# Altium project NeuroMother.PrjPcb
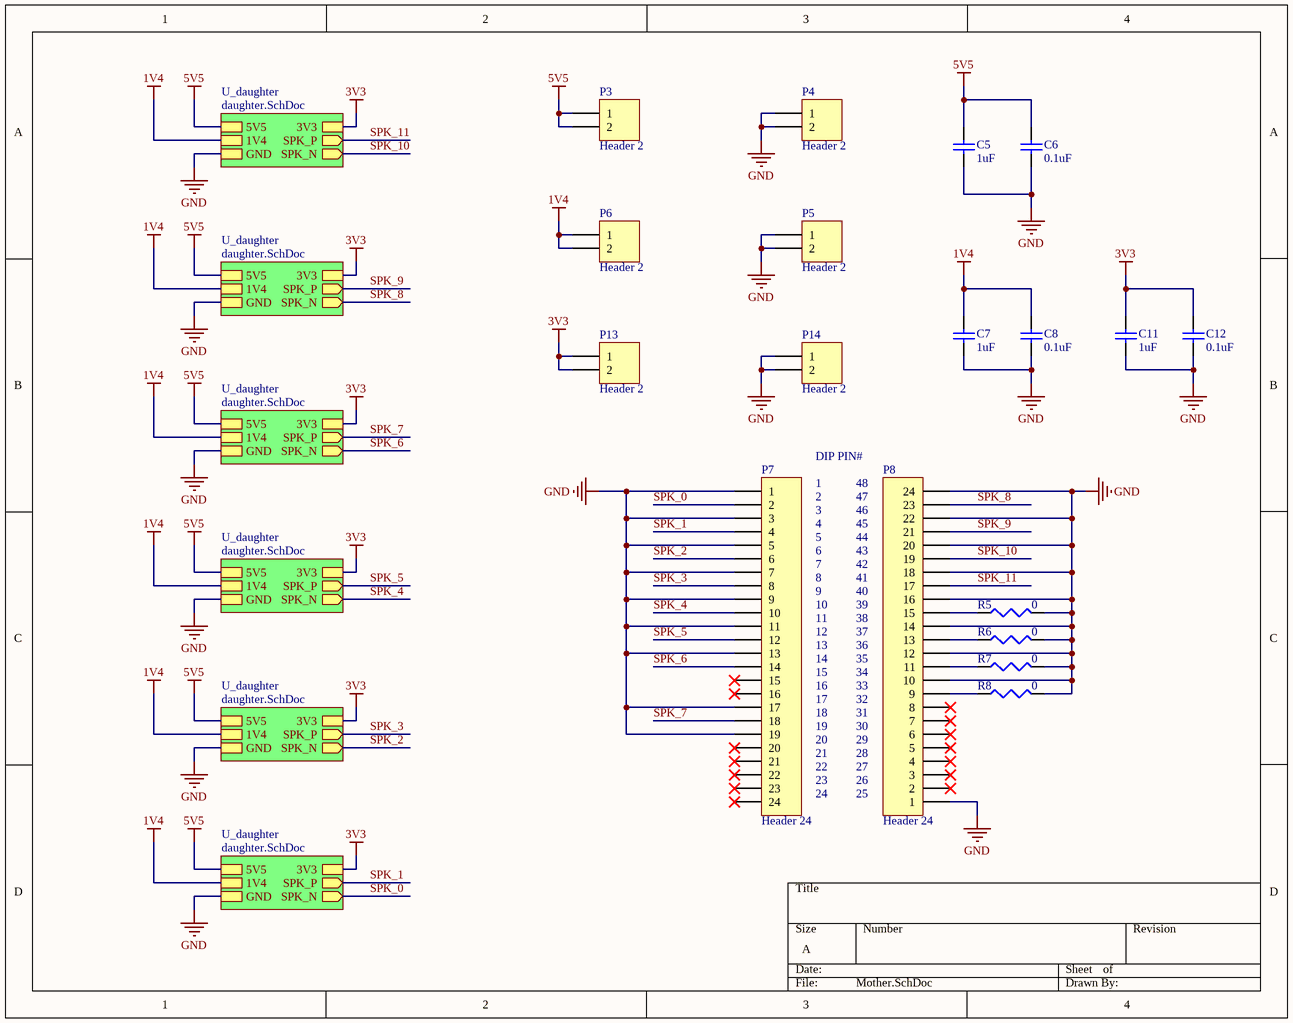
[diagram p0: Mother.SchDoc]
2 sheets, 186 parts. Net scope: strictly hierarchical (ports join the sheet entries above them; power ports are local).
Board file: NeuroMother_A.PcbDoc
Sheets:
  Mother.SchDoc
    U_daughter = daughter.SchDoc
    U_daughter = daughter.SchDoc
    U_daughter = daughter.SchDoc
    U_daughter = daughter.SchDoc
    U_daughter = daughter.SchDoc
    U_daughter = daughter.SchDoc

## Sheet Mother.SchDoc
size A; SheetNumber: 1; SheetTotal: 2

### Parts
C5  1uF  [SMD-0805]
C6  0.1uF  [SMD-0603]
C7  1uF  [SMD-0805]
C8  0.1uF  [SMD-0603]
C11  1uF  [SMD-0805]
C12  0.1uF  [SMD-0603]
P3  Header 2  [HDR1X2]
P4  Header 2  [HDR1X2]
P5  Header 2  [HDR1X2]
P6  Header 2  [HDR1X2]
P7  Header 24  [HDR1X24]
P8  Header 24  [HDR1X24]
P13  Header 2  [HDR1X2]
P14  Header 2  [HDR1X2]
R5  0  [SMD-0603]
R6  0  [SMD-0603]
R7  0  [SMD-0603]
R8  0  [SMD-0603]

### Sub-sheets
U_daughter = daughter.SchDoc: 1V4, 5V5, SPK_P (out), SPK_N (out), GND, 3V3
U_daughter = daughter.SchDoc: 1V4, 5V5, SPK_P (out), SPK_N (out), GND, 3V3
U_daughter = daughter.SchDoc: 1V4, 5V5, SPK_P (out), SPK_N (out), GND, 3V3
U_daughter = daughter.SchDoc: 1V4, 5V5, SPK_P (out), SPK_N (out), GND, 3V3
U_daughter = daughter.SchDoc: 1V4, 5V5, SPK_P (out), SPK_N (out), GND, 3V3
U_daughter = daughter.SchDoc: 1V4, 5V5, SPK_P (out), SPK_N (out), GND, 3V3

### Nets
1V4: C7.2 C8.2 P6.1 P6.2 ; sheet U_daughter/1V4, sheet U_daughter/1V4, sheet U_daughter/1V4, sheet U_daughter/1V4, sheet U_daughter/1V4, sheet U_daughter/1V4
3V3: C11.2 C12.2 P13.1 P13.2 ; sheet U_daughter/3V3, sheet U_daughter/3V3, sheet U_daughter/3V3, sheet U_daughter/3V3, sheet U_daughter/3V3, sheet U_daughter/3V3
5V5: C5.2 C6.2 P3.1 P3.2 ; sheet U_daughter/5V5, sheet U_daughter/5V5, sheet U_daughter/5V5, sheet U_daughter/5V5, sheet U_daughter/5V5, sheet U_daughter/5V5
GND: C5.1 C6.1 C7.1 C8.1 C11.1 C12.1 P4.1 P4.2 P5.1 P5.2 P7.1 P7.3 P7.5 P7.7 P7.9 P7.11 P7.13 P7.17 P7.19 P8.1 P8.10 P8.12 P8.14 P8.16 P8.18 P8.20 P8.22 P8.24 P14.1 P14.2 R5.2 R6.2 R7.2 R8.2 ; sheet U_daughter/GND, sheet U_daughter/GND, sheet U_daughter/GND, sheet U_daughter/GND, sheet U_daughter/GND, sheet U_daughter/GND
SPK_0: P7.2 ; sheet U_daughter/SPK_N
SPK_1: P7.4 ; sheet U_daughter/SPK_P
SPK_2: P7.6 ; sheet U_daughter/SPK_N
SPK_3: P7.8 ; sheet U_daughter/SPK_P
SPK_4: P7.10 ; sheet U_daughter/SPK_N
SPK_5: P7.12 ; sheet U_daughter/SPK_P
SPK_6: P7.14 ; sheet U_daughter/SPK_N
SPK_7: P7.18 ; sheet U_daughter/SPK_P
SPK_8: P8.23 ; sheet U_daughter/SPK_N
SPK_9: P8.21 ; sheet U_daughter/SPK_P
SPK_10: P8.19 ; sheet U_daughter/SPK_N
SPK_11: P8.17 ; sheet U_daughter/SPK_P
NetP8_9: P8.9 R8.1
NetP8_11: P8.11 R7.1
NetP8_13: P8.13 R6.1
NetP8_15: P8.15 R5.1

Not connected (* = marked no-connect by the designer): P7 15* 16* 20* 21* 22* 23* 24*; P8 2* 3* 4* 5* 6* 7* 8*

### Notes on the sheet
- DIP PIN#
- 1
- 2
- 48
- 47
- 3
- 4
- 5
- 6
- 7
- 46
- 45
- 44
- 43
- 42
- 8
- 9
- 10
- 11
- 12
- 41
- 40
- 39
- 38
- 37
- 13
- 14
- 15
- 16
- 17
- 36
- 35
- 34
- 33
- 32
- 18
- 19
- 20
- 21
- 22
- 31
- 30
- 29
- 28
- 27
- 23
- 24
- 26
- 25

### Library data of the parts
C5 C7 C11 = CAP0805: Ceramic Capacitor 0805 Imperial (2012 Metric)
C6 C8 C12 = CAP0603: Ceramic Capacitor 0603
P3-P6 P13 P14 = Header 2: Header, 2-Pin; LatestRevisionDate: 17-Jul-2002; LatestRevisionNote: Re-released for DXP Platform.; Publisher: Altium Limited
P7 P8 = Header 24: Header, 24-Pin; LatestRevisionDate: 17-Jul-2002; LatestRevisionNote: Re-released for DXP Platform.; Publisher: Altium Limited
R5-R8 = RES0603: Resistor-0603

## Sheet daughter.SchDoc
size 431 x 279 mm; SheetNumber: 2; SheetTotal: 2
Used 6 times, as channels U_daughter, U_daughter, U_daughter, U_daughter, U_daughter, U_daughter. Parts and nets are listed once, with the designators drawn on the sheet.
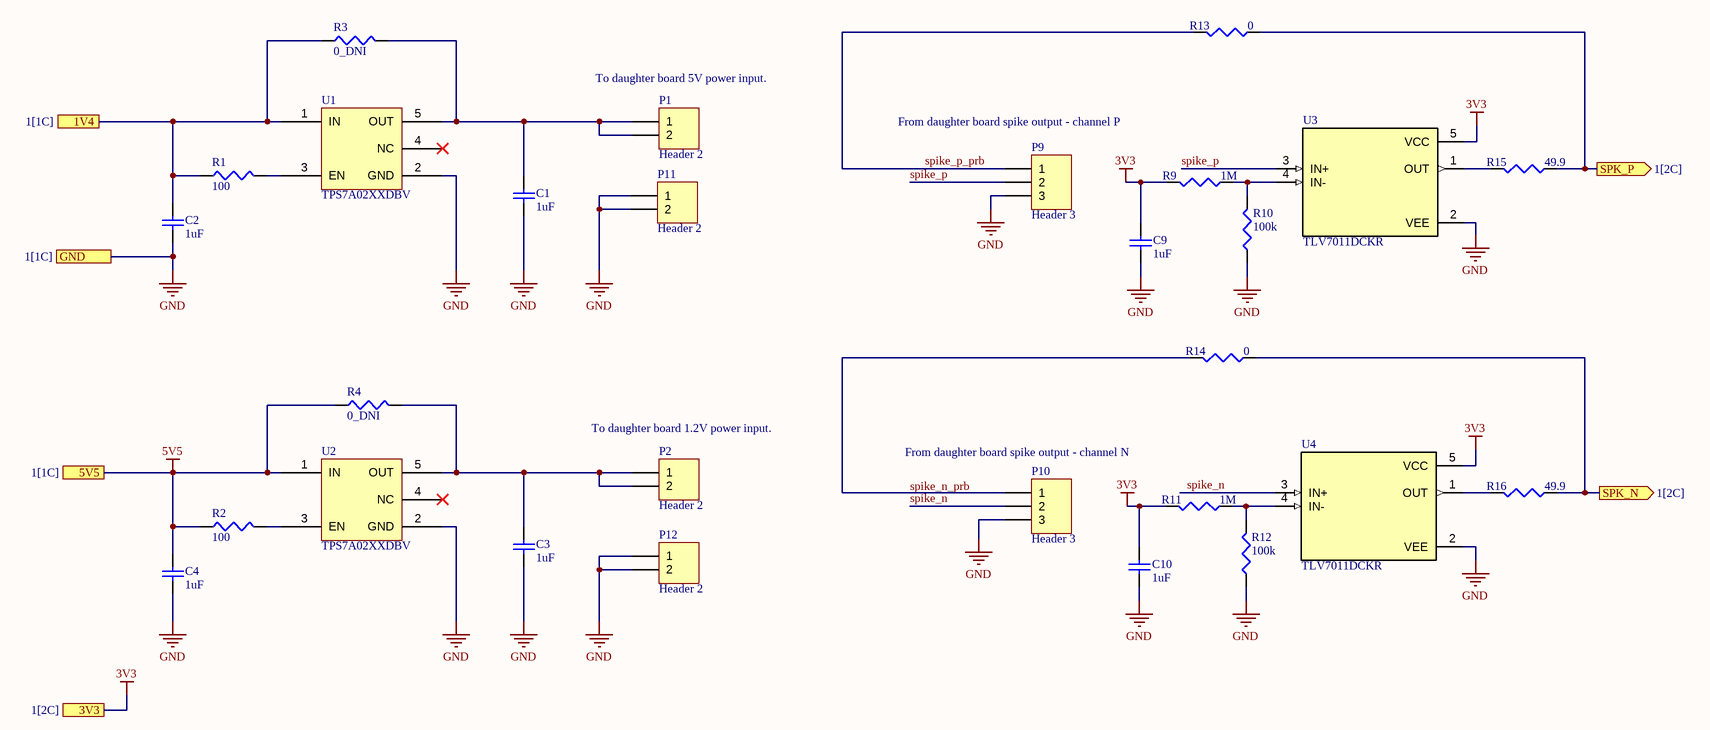
[diagram p1: daughter.SchDoc]

### Parts
C1  1uF  [SMD-0603]
C2  1uF  [SMD-0603]
C3  1uF  [SMD-0603]
C4  1uF  [SMD-0603]
C9  1uF  [SMD-0603]
C10  1uF  [SMD-0603]
P1  Header 2  [HDR1X2]
P2  Header 2  [HDR1X2]
P9  Header 3  [HDR1X3]
P10  Header 3  [HDR1X3]
P11  Header 2  [HDR1X2]
P12  Header 2  [HDR1X2]
R1  100  [SMD-0603]
R2  100  [SMD-0603]
R3  0_DNI  [SMD-0603]
R4  0_DNI  [SMD-0603]
R9  1M  [SMD-0603]
R10  100k  [SMD-0603]
R11  1M  [SMD-0603]
R12  100k  [SMD-0603]
R13  0  [SMD-0603]
R14  0  [SMD-0603]
R15  49.9  [SMD-0603]
R16  49.9  [SMD-0603]
U1  TPS7A02XXDBV  [SOT95P280X145-5N]
U2  TPS7A02XXDBV  [SOT95P280X145-5N]
U3  TLV7011DCKR  [SOT65P210X110-5N]
U4  TLV7011DCKR  [SOT65P210X110-5N]

### Ports
1V4 (see 1[1C]), 3V3 (see 1[2C]), 5V5 (see 1[1C]), GND (see 1[1C]), SPK_N (out, see 1[2C]), SPK_P (out, see 1[2C])

### Nets
3V3: C9.2 C10.2 R9.2 R11.2 U3.5(VCC) U4.5(VCC) ; port 3V3
5V5: C4.2 R2.1 R4.1 U2.1(IN) ; port 5V5
GND: C1.1 C2.1 C3.1 C4.1 C9.1 C10.1 P9.3 P10.3 P11.1 P11.2 P12.1 P12.2 R10.1 R12.1 U1.2(GND) U2.2(GND) U3.2(VEE) U4.2(VEE) ; port GND
1V4: C2.2 R1.1 R3.1 U1.1(IN) ; port 1V4
spike_n: P10.2 U4.3(IN+)
spike_p: P9.2 U3.3(IN+)
spike_p_prb: P9.1 R13.2
SPK_N: R14.1 R16.1 ; port SPK_N
SPK_P: R13.1 R15.1 ; port SPK_P
NetC1_2: C1.2 P1.1 P1.2 R3.2 U1.5(OUT)
NetC3_2: C3.2 P2.1 P2.2 R4.2 U2.5(OUT)
NetP10_1: P10.1 R14.2
NetR1_2: R1.2 U1.3(EN)
NetR2_2: R2.2 U2.3(EN)
NetR9_1: R9.1 R10.2 U3.4(IN-)
NetR11_1: R11.1 R12.2 U4.4(IN-)
NetR15_2: R15.2 U3.1(OUT)
NetR16_2: R16.2 U4.1(OUT)

Not connected (* = marked no-connect by the designer): U1 4(NC)*; U2 4(NC)*

### Channels
U_daughter: designators end in _6; ports 1V4=1V4 3V3=3V3 5V5=5V5 GND=GND SPK_N=SPK_10 SPK_P=SPK_11
U_daughter: designators end in _5; ports 1V4=1V4 3V3=3V3 5V5=5V5 GND=GND SPK_N=SPK_8 SPK_P=SPK_9
U_daughter: designators end in _4; ports 1V4=1V4 3V3=3V3 5V5=5V5 GND=GND SPK_N=SPK_6 SPK_P=SPK_7
U_daughter: designators end in _3; ports 1V4=1V4 3V3=3V3 5V5=5V5 GND=GND SPK_N=SPK_4 SPK_P=SPK_5
U_daughter: designators end in _2; ports 1V4=1V4 3V3=3V3 5V5=5V5 GND=GND SPK_N=SPK_2 SPK_P=SPK_3
U_daughter: designators end in _1; ports 1V4=1V4 3V3=3V3 5V5=5V5 GND=GND SPK_N=SPK_0 SPK_P=SPK_1

### Notes on the sheet
- (near P1) To daughter board 5V power input.
- From daughter board spike output - channel P
- (near P2) To daughter board 1.2V power input.
- From daughter board spike output - channel N
- Labels drawn without touching a wire or pin: spike_n_prb
- DWG. NO.
- REV.
- SHT.
- THIS DOCUMENT AND THE DATA DISCLOSED HEREIN OR HEREWITH IS THE PROPERTY OF ALTIUM LIMITED AND MAY BE FREELY DISTRIBUTED IN WHOLE. NO RIGHTS ARE RESERVED OR EXPRESS OR IMPLIED WARANTEE GIVEN.
- REVISION
- DESCRIPTION
- DATE
- APPROVED
- ENG:
- APPROVALS
- PROJECT
- DSN:
- CHK:
- REFERENCE DOCUMENTS
- PROJECT REVISION:
- TITLE
- DOCUMENT REVISION:
- DESIGN ITEM:
- BOM:
- FAB DWG:
- PCB DWG:
- ASSY DWG:
- SCALE:
- SIZE
- B
- CAGE CODE
- FILE NAME
- DWG NO.
- SHEET
- OF
- REV

### Library data of the parts
C1-C4 C9 C10 = CAP0603: Ceramic Capacitor 0603
P1 P2 P11 P12 = Header 2: Header, 2-Pin; LatestRevisionDate: 17-Jul-2002; LatestRevisionNote: Re-released for DXP Platform.; Publisher: Altium Limited
P9 P10 = Header 3: Header, 3-Pin; LatestRevisionDate: 17-Jul-2002; LatestRevisionNote: Re-released for DXP Platform.; Publisher: Altium Limited
R1-R4 R9-R16 = RES0603: Resistor-0603
U1 U2 = TPS7A02XXDBV: TPS7A02 Nanopower IQ, 25-nA, 200-mA, Low-Dropout Voltage Regulator With Fast / Transient Response
U3 U4 = TLV7011DCKR: Low power, small size comparator with push-pull output; MF: Texas Instruments; Package: SOT-SC70-5 Texas Instruments; Availability: In Stock; Purchase-URL: https://pricing.snapeda.com/search/part/TLV7011DCKR/?ref=eda; MP: TLV7011DCKR; Value: *; SnapEDA_Link: https://www.snapeda.com/parts/TLV7011DCKR/Texas+Instruments/view-part/?ref=snap; Price: None; Check_prices: https://www.snapeda.com/parts/TLV7011DCKR/Texas+Instruments/view-part/?ref=eda

## Nets that join several sheets
1V4: Mother (C7.2 C8.2 P6.1 P6.2), U_daughter (C2_6.2 R1_6.1 R3_6.1 U1_6.1), U_daughter (C2_5.2 R1_5.1 R3_5.1 U1_5.1), U_daughter (C2_4.2 R1_4.1 R3_4.1 U1_4.1), U_daughter (C2_3.2 R1_3.1 R3_3.1 U1_3.1), U_daughter (C2_2.2 R1_2.1 R3_2.1 U1_2.1), U_daughter (C2_1.2 R1_1.1 R3_1.1 U1_1.1)
3V3: Mother (C11.2 C12.2 P13.1 P13.2), U_daughter (6 pins), U_daughter (6 pins), U_daughter (6 pins), U_daughter (6 pins), U_daughter (6 pins), U_daughter (6 pins)
5V5: Mother (C5.2 C6.2 P3.1 P3.2), U_daughter (C4_6.2 R2_6.1 R4_6.1 U2_6.1), U_daughter (C4_5.2 R2_5.1 R4_5.1 U2_5.1), U_daughter (C4_4.2 R2_4.1 R4_4.1 U2_4.1), U_daughter (C4_3.2 R2_3.1 R4_3.1 U2_3.1), U_daughter (C4_2.2 R2_2.1 R4_2.1 U2_2.1), U_daughter (C4_1.2 R2_1.1 R4_1.1 U2_1.1)
GND: Mother (34 pins), U_daughter (18 pins), U_daughter (18 pins), U_daughter (18 pins), U_daughter (18 pins), U_daughter (18 pins), U_daughter (18 pins)
SPK_0: Mother (P7.2), U_daughter (R14_1.1 R16_1.1)
SPK_1: Mother (P7.4), U_daughter (R13_1.1 R15_1.1)
SPK_2: Mother (P7.6), U_daughter (R14_2.1 R16_2.1)
SPK_3: Mother (P7.8), U_daughter (R13_2.1 R15_2.1)
SPK_4: Mother (P7.10), U_daughter (R14_3.1 R16_3.1)
SPK_5: Mother (P7.12), U_daughter (R13_3.1 R15_3.1)
SPK_6: Mother (P7.14), U_daughter (R14_4.1 R16_4.1)
SPK_7: Mother (P7.18), U_daughter (R13_4.1 R15_4.1)
SPK_8: Mother (P8.23), U_daughter (R14_5.1 R16_5.1)
SPK_9: Mother (P8.21), U_daughter (R13_5.1 R15_5.1)
SPK_10: Mother (P8.19), U_daughter (R14_6.1 R16_6.1)
SPK_11: Mother (P8.17), U_daughter (R13_6.1 R15_6.1)